# Altium schematic sheet DK TT.SchDoc
size A3
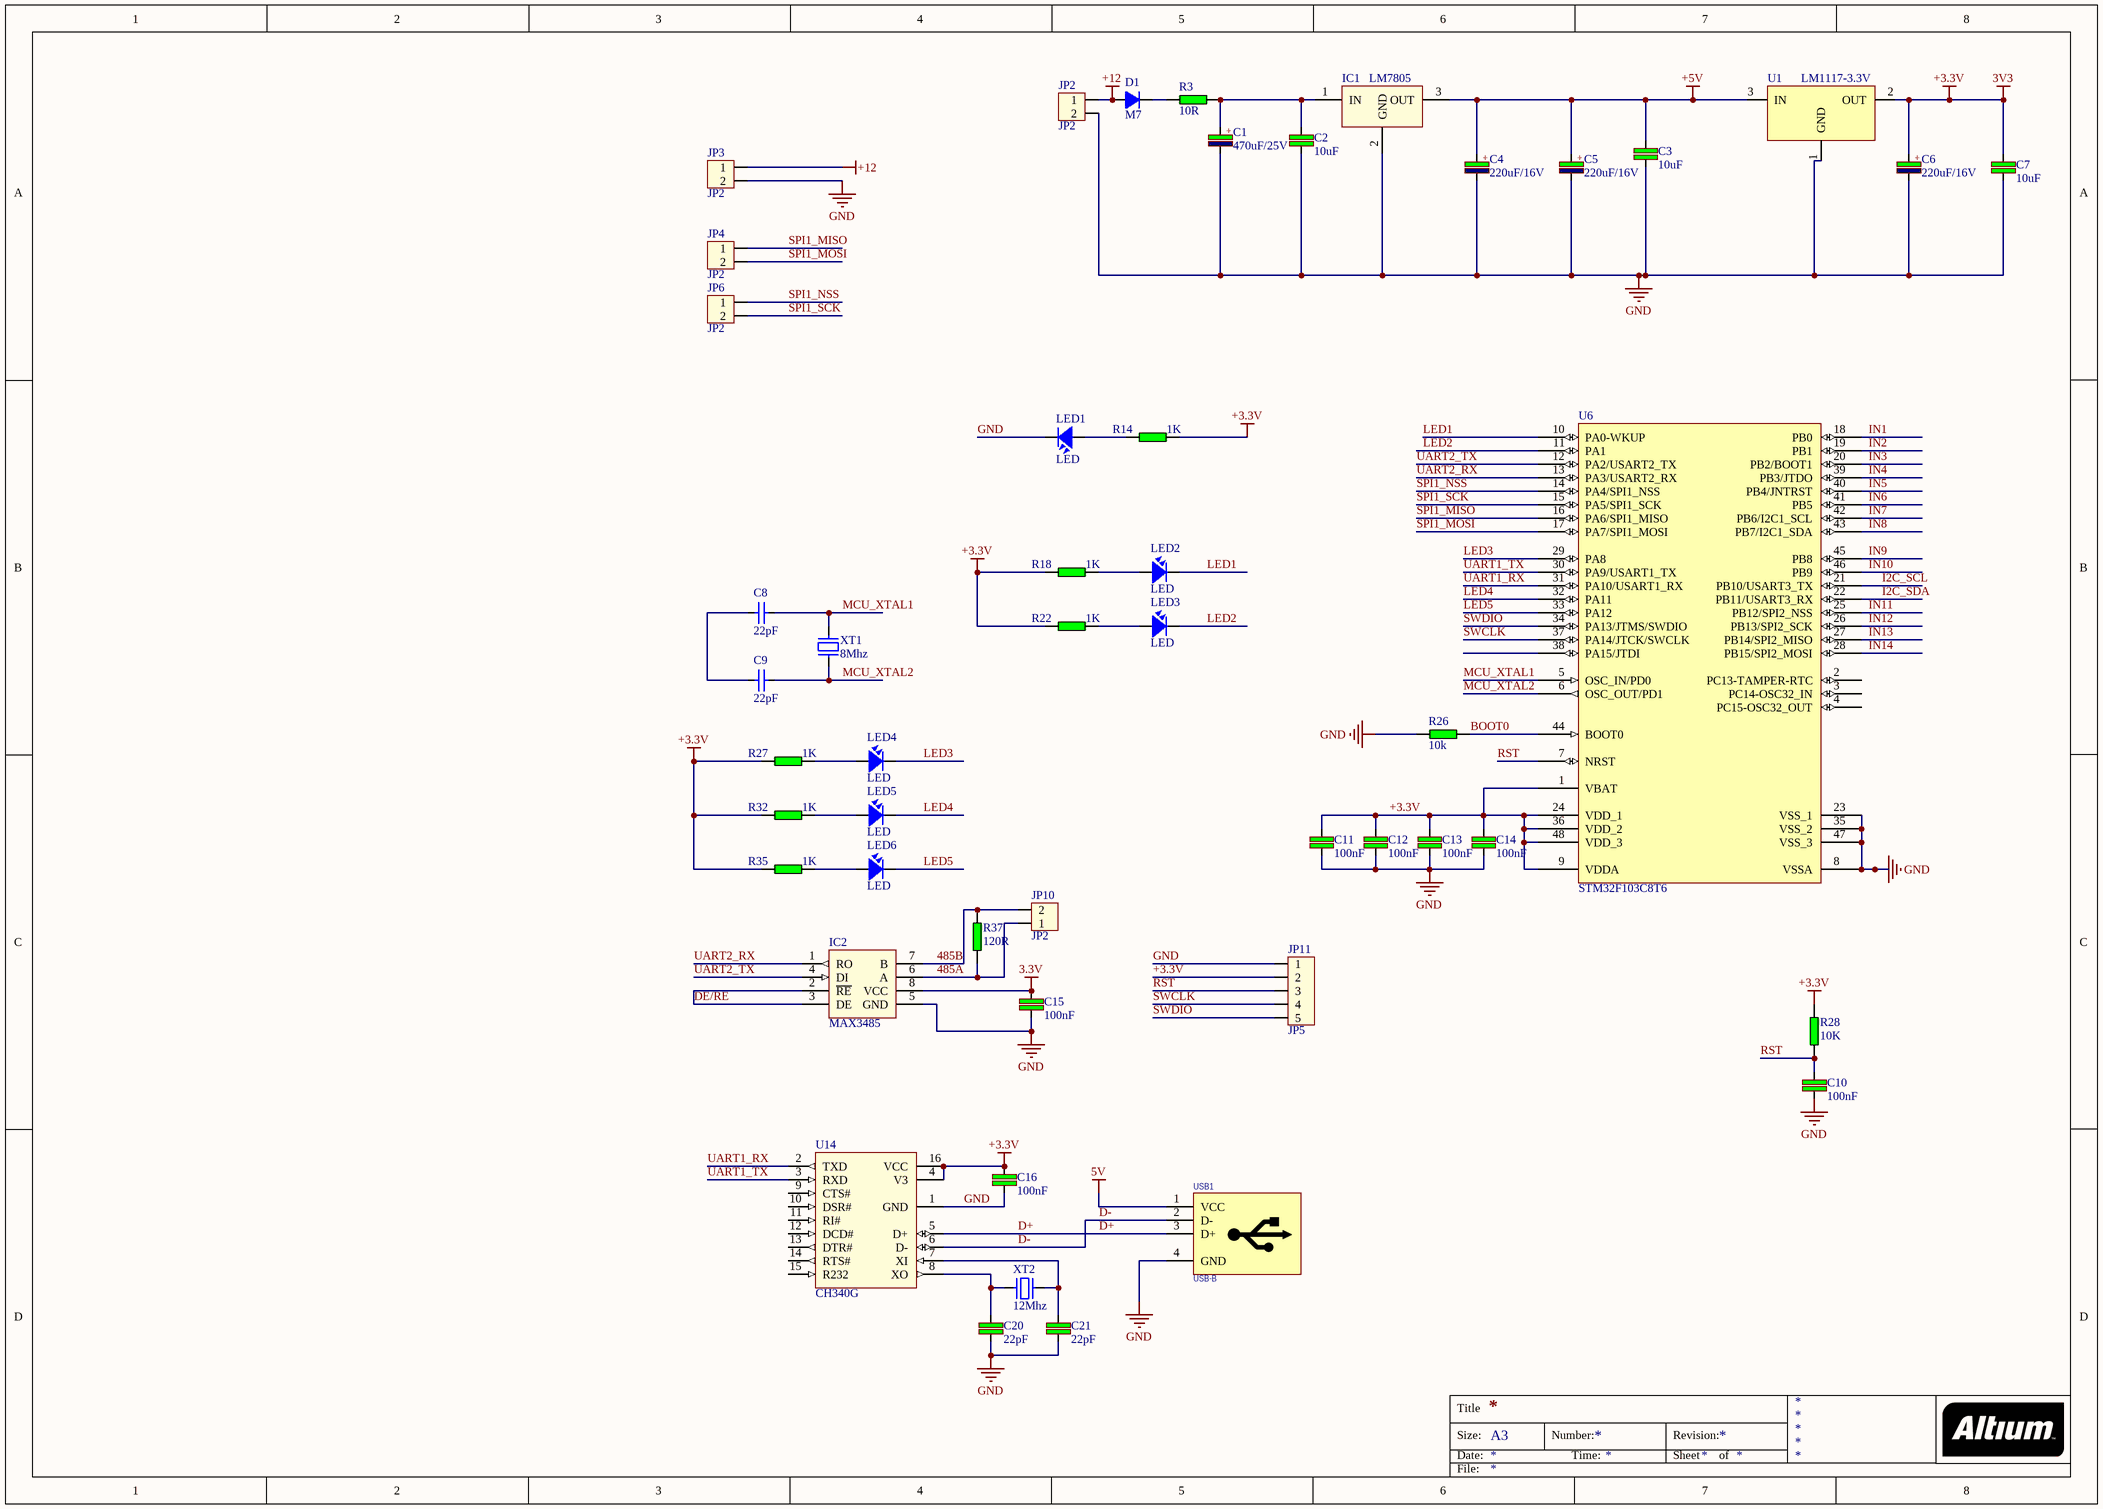
[diagram p0: DK TT.SchDoc]

## Parts
C1  470uF/25V  [CP_1000UF/25V_NAM - cao]
C2  10uF  [C-0805]
C3  10uF  [C-0805]
C4  220uF/16V  [CA-ALU-5L]
C5  220uF/16V  [CA-ALU-5L]
C6  220uF/16V  [CA-ALU-5L]
C7  10uF  [C-0805]
C8  22pF  [CAP_0402]
C9  22pF  [CAP_0402]
C10  100nF  [C-0805]
C11  100nF  [C-0805]
C12  100nF  [C-0805]
C13  100nF  [C-0805]
C14  100nF  [C-0805]
C15  100nF  [C-0805]
C16  100nF  [C-0805]
C20  22pF  [C-0805]
C21  22pF  [C-0805]
D1  M7  [SMA11]
IC1  LM7805  [TO-252 7805]
IC2  MAX3485  [SOIC-8]
JP2  JP2  [KF2-5.08T]
JP3  JP2  [KF2-5.08T]
JP4  JP2  [KF2-5.08T]
JP6  JP2  [KF2-5.08T]
JP10  JP2  [KF2-5.08T]
JP11  JP5  [JP5-D1T]
LED1  LED  [LED-0805-Red]
LED2  LED  [LED-0805-Red]
LED3  LED  [LED-0805-Red]
LED4  LED  [LED-3]
LED5  LED  [LED-3]
LED6  LED  [LED-3]
R3  10R  [R-1206]
R14  1K  [R-0805]
R18  1K  [R-0805]
R22  1K  [R-0805]
R26  10k  [R-0805]
R27  1K  [R-0805]
R28  10K  [R-0805]
R32  1K  [R-0805]
R35  1K  [R-0805]
R37  120R  [R-0805]
U1  LM1117-3.3V  [SOT223-4N]
U6  STM32F103C8T6  [LQFP48_L]
U14  CH340G  [SOIC-16]
USB1  USB-B  [USB-B]
XT1  8Mhz  [XTAL-RU49/4]
XT2  12Mhz  [XTAL-RU49/4]

## Nets
3.3V: C15.1 IC2.8(VCC)
5V: USB1.1(VCC)
+3.3V: C6.1 C7.2 C11.1 C12.1 C13.1 C14.1 C16.2 JP11.2 R14.1 R18.2 R22.2 R27.2 R28.1 R32.2 R35.2 U1.2(OUT) U6.1(VBAT) U6.9(VDDA) U6.24(VDD_1) U6.36(VDD_2) U6.48(VDD_3) U14.4(V3) U14.16(VCC)  [also labelled 3V3]
+5V: C3.2 C4.1 C5.1 IC1.3(OUT) U1.3(IN)
+12: D1.1(A) JP2.1 JP3.1
GND: C1.2 C2.1 C3.1 C4.2 C5.2 C6.2 C7.1 C10.1 C11.2 C12.2 C13.2 C14.2 C15.2 C16.1 C20.1 C21.1 IC1.2(GND) IC2.5(GND) JP2.2 JP3.2 JP11.1 LED1.2 R26.1 U1.1(GND) U6.8(VSSA) U6.23(VSS_1) U6.35(VSS_2) U6.47(VSS_3) U14.1(GND) USB1.4(GND)
485A: IC2.6(A) JP10.1 R37.2
485B: IC2.7(B) JP10.2 R37.1
BOOT0: R26.2 U6.44(BOOT0)
D+: U14.5(D+) USB1.3(D+)
D-: U14.6(D-) USB1.2(D-)
DE/RE: IC2.2(~{RE}) IC2.3(DE)
I2C_SCL: U6.21(PB10/USART3_TX)
I2C_SDA: U6.22(PB11/USART3_RX)
IN1: U6.18(PB0)
IN2: U6.19(PB1)
IN3: U6.20(PB2/BOOT1)
IN4: U6.39(PB3/JTDO)
IN5: U6.40(PB4/JNTRST)
IN6: U6.41(PB5)
IN7: U6.42(PB6/I2C1_SCL)
IN8: U6.43(PB7/I2C1_SDA)
IN9: U6.45(PB8)
IN10: U6.46(PB9)
IN11: U6.25(PB12/SPI2_NSS)
IN12: U6.26(PB13/SPI2_SCK)
IN13: U6.27(PB14/SPI2_MISO)
IN14: U6.28(PB15/SPI2_MOSI)
LED1: LED2.2 U6.10(PA0-WKUP)
LED2: LED3.2 U6.11(PA1)
LED3: LED4.2 U6.29(PA8)
LED4: LED5.2 U6.32(PA11)
LED5: LED6.2 U6.33(PA12)
MCU_XTAL1: C8.1 U6.5(OSC_IN/PD0) XT1.1
MCU_XTAL2: C9.1 U6.6(OSC_OUT/PD1) XT1.2
RST: C10.2 JP11.3 R28.2 U6.7(NRST)
SPI1_MISO: JP4.1 U6.16(PA6/SPI1_MISO)
SPI1_MOSI: JP4.2 U6.17(PA7/SPI1_MOSI)
SPI1_NSS: JP6.1 U6.14(PA4/SPI1_NSS)
SPI1_SCK: JP6.2 U6.15(PA5/SPI1_SCK)
SWCLK: JP11.4 U6.37(PA14/JTCK/SWCLK)
SWDIO: JP11.5 U6.34(PA13/JTMS/SWDIO)
UART1_RX: U6.31(PA10/USART1_RX) U14.2(TXD)
UART1_TX: U6.30(PA9/USART1_TX) U14.3(RXD)
UART2_RX: IC2.1(RO) U6.13(PA3/USART2_RX)
UART2_TX: IC2.4(DI) U6.12(PA2/USART2_TX)
NetC1_1: C1.1 C2.2 IC1.1(IN) R3.2
NetC8_2: C8.2 C9.2
NetC20_2: C20.2 U14.8(XO) XT2.1
NetC21_2: C21.2 U14.7(XI) XT2.2
NetD1_2: D1.2(K) R3.1
NetLED1_1: LED1.1 R14.2
NetLED2_1: LED2.1 R18.1
NetLED3_1: LED3.1 R22.1
NetLED4_1: LED4.1 R27.1
NetLED5_1: LED5.1 R32.1
NetLED6_1: LED6.1 R35.1

Not connected (* = marked no-connect by the designer): U6 2(PC13-TAMPER-RTC) 3(PC14-OSC32_IN) 4(PC15-OSC32_OUT) 38(PA15/JTDI); U14 9(CTS#) 10(DSR#) 11(RI#) 12(DCD#) 13(DTR#) 14(RTS#) 15(R232)

## Notes on the sheet
- Title
- Size:
- Date:
- A3
- Number:
- Time:
- Revision:
- Sheet
- of
- File:
- (in symbol CP3) +
- (in symbol CP4) +

## Library data of the parts
C1 = CP4: 470uF/35V; Manufacturer: Würth Elektronik; Part number: 860020575014; Value: 470uF; User_Description: CAP ALUM 470UF 20% 35V RADIAL; Category: CAPACITOR
C2 C3 C7 C10-C14 = C: Cap SMD; Value: 103
C4-C6 = CP3: Cap 100uF/35V - 470uF/16V; Value: 100uF/35V/50V; Description 1: 1000uF/6,3V - 470uF/16V - 330uF - 25V; Description 2: 220uF/35V - 100uF/50V - 63V - 4,7uF/200V; Description 3: 22uF => 33uF100V - 3,3uF => 4,7uF/250V; Description 4: 2,2uF =>3,3uF/350 - 2,2uF/400V - 1uF/450V
C8 C9 = CapSMD: Capacitor; Value: 33p; Published: 8-Jun-2000; LatestRevisionDate: 17-Jul-2002; LatestRevisionNote: Re-released for DXP Platform.; PackageReference: RAD-0.3; Publisher: Altium Limited
C15 C16 = C: Cap SMD; Manufacturer: Samsung Electro-Mechanics; Part number: CL21B104KBCNNWC; User_Description: CAP CER 0.1UF 50V X7R 0805; Value: 100nF; Category: CAPACITOR; Package: 0805
C20 C21 = C: Cap SMD; Manufacturer: Samsung Electro-Mechanics; Part number: CL21C220JBANFNC; User_Description: CAP CER 22PF 50V C0G/NP0 0805; Value: 22pF; Category: CAPACITOR; Package: 0805
D1 = D1A: Diode 1A; Value: 1N4007
IC1 = LM78xx: On ap +, from + 5 to + 24VDC; Value: LM7805
IC2 = MAX3362EKA+T: IC TRANSCEIVER HALF 1/1 SOT23-8; Manufacturer: Maxim Integrated; Category: Interface - Drivers; Package: SOT-23-8; User_Description: IC TRANSCEIVER HALF 1/1 SOT23-8; Part number: MAX3362EKA+T
JP2-JP4 JP6 JP10 = Con2: Connector 2; Value: Connector 2
JP11 = Con5: Connector 5; Value: Connector 5
LED1-LED6 = LED: LED Single colour Green and Red; Value: LED 3 ly Single Colour
R3 R14 R18 R22 R26 R27 R32 R35 R37 = RES: Resistor 1/4W; Value: R1/4W - 1K
R28 = RES_1: Resistor 1/4W; Value: R1/4W - 1K
U1 = LM1117: Creator: Nguyen Ba Bien; Website: http://group3i.net
U14 = CH340G: USB to UART Interface; Manufacturer: WCH; Category: IC UART Interface; Package: SOIC-16; Part number: CH340G; User_Description: USB to UART Interface
USB1 = USB-B: CONN USB 2.0 RT ANGLE TYPE B; Manufacturer: Stewart Connector; Part number: SS-52300-001; Category: Connectors, Interconnects; Package: Through Hole; User_Description: CONN USB 2.0 RT ANGLE TYPE B
XT1 = XT2: CRYSTAL 12.0000MHZ 18PF SMD; Manufacturer: IQD Frequency Products; Part number: LFXTAL036356REEL; Value: 12Mhz; Category: Crystals; Package: HC-49/US; User_Description: CRYSTAL 12.0000MHZ 18PF SMD
XT2 = XT2: CRYSTAL 12.0000MHZ 18PF SMD; Manufacturer: IQD Frequency Products; Part number: LFXTAL036356REEL; Value: 12Mhz; Category: Crystals; Package: HC-49/US; User_Description: CRYSTAL 12.0000MHZ 18PF SMD